# EAGLE schematic reset_circuit (EAGLE 9.2.2)
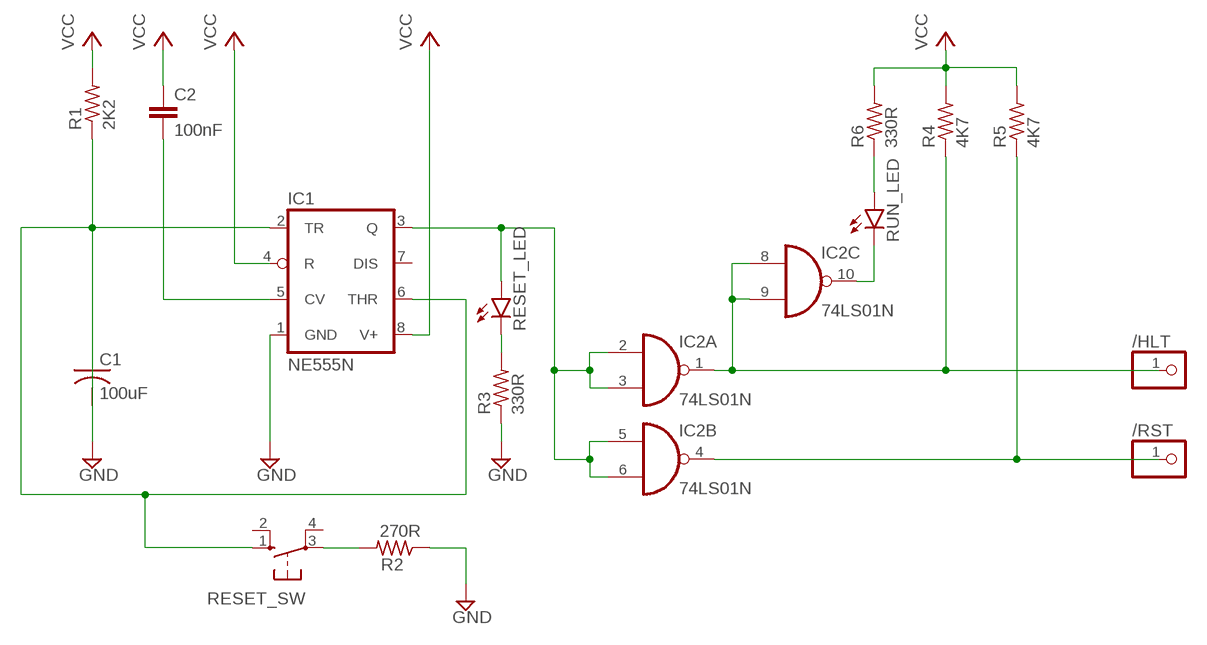
[diagram p0: schematic, sheet 1]

## Parts
/HLT  PINHD-1X1  [1X01]
/RST  PINHD-1X1  [1X01]
C1  100uF  C-US025-025X050  [C025-025X050]
C2  100nF  C2,5-3  [C2.5-3]
IC1  NE555N  [DIL08]
IC2  74LS01N  [DIL14]
R1  2K2  R-US_0204/7  [0204/7]
R2  270R  R-US_0204/7  [0204/7]
R3  330R  R-US_0204/7  [0204/7]
R4  4K7  R-US_0204/7  [0204/7]
R5  4K7  R-US_0204/7  [0204/7]
R6  330R  R-US_0204/7  [0204/7]
RESET_LED  LED5MM  [LED5MM]
RESET_SW  10-XX  [B3F-10XX]
RUN_LED  LED5MM  [LED5MM]

## Nets
GND: C1.1 IC1.1(GND) R2.1 R3.1
N$2: C1.2 IC1.2(TR) IC1.6(THR) R1.1 RESET_SW.1(S)
N$3: C2.2 IC1.5(CV)
N$4: IC1.3(Q) IC2.2(A:I0) IC2.3(A:I1) IC2.5(B:I0) IC2.6(B:I1) RESET_LED.A
N$5: R3.2 RESET_LED.K(C)
N$6: /HLT.1 IC2.1(A:O) IC2.8(C:I0) IC2.9(C:I1) R4.1
N$7: /RST.1 IC2.4(B:O) R5.1
N$8: IC2.10(C:O) RUN_LED.K(C)
N$9: R6.1 RUN_LED.A
N$10: R2.2 RESET_SW.3(P)
VCC: C2.1 IC1.4(R) IC1.8(V+) R1.2 R4.2 R5.2 R6.2
Unconnected: IC1.7(DIS) IC2.11(D:I0) IC2.12(D:I1) IC2.13(D:O) RESET_SW.2(S1) RESET_SW.4(P1)

## Power pins joined to a net without a drawn wire
GND: IC2.7(P:GND)
VCC: IC2.14(P:VCC)

## Library data of the parts
/HLT /RST = pinhead:PINHD-1X1: PIN HEADER
C1 = rcl:C-US: CAPACITOR, American symbol; SPICEPREFIX: C
C2 = capacitor-wima:C: CAPACITOR naming: grid - package width
IC1 = linear:*555: TIMER
IC2 = 74xx-eu:74*01: Quad 2-input NAND gate, open collector
R1-R6 = rcl:R-US_: RESISTOR, American symbol; SPICEPREFIX: R
RESET_LED RUN_LED = led:LED: LED OSRAM: - CHIPLED LG R971, LG N971, LY N971, LG Q971, LY Q971, LO R971, LY R971 LH N974, LH R974 LS Q976, LO Q976, LY Q976 LO Q996 - Hyper CHIPLED LW Q18S LB Q993, LB Q99A, LB R99A - SideLED LS A670, LO A670, LY A670, LG A670, LP A670 LB A673, LV A673, LT A673, LW A673 LH A674 LY A675 LS A676, LA A676, LO A676, LY A676, LW A676 LS A679, LY A679, LG A679 - Hyper Micro SIDELED® LS Y876, LA Y876, LO Y876, LY Y876 LT Y87S - SmartLED LW L88C, LW L88S LB L89C, LB L89S, LG L890 LS L89K, LO L89K, LY L89K LS L896, LA L896, LO L896, LY L896 - TOPLED LS T670, LO T670, LY T670, LG T670, LP T670 LSG T670, LSP T670, LSY T670, LOP T670, LYG T670 LG T671, LOG T671, LSG T671 LB T673, LV T673, LT T673, LW T673 LH T674 LS T676, LA T676, LO T676, LY T676, LB T676, LH T676, LSB T676, LW T676 LB T67C, LV T67C, LT T67C, LS T67K, LO T67K, LY T67K, LW E67C LS E67B, LA E67B, LO E67B, LY E67B, LB E67C, LV E67C, LT E67C LW T67C LS T679, LY T679, LG T679 LS T770, LO T770, LY T770, LG T770, LP T770 LB T773, LV T773, LT T773, LW T773 LH T774 LS E675, LA E675, LY E675, LS T675 LS T776, LA T776, LO T776, LY T776, LB T776 LHGB T686 LT T68C, LB T68C - Hyper Mini TOPLED® LB M676 - Mini TOPLED Santana® LG M470 LS M47K, LO M47K, LY M47K Source: http://www.osram.convergy.de LUXEON: - LUMILED® LXK2-PW12-R00, LXK2-PW12-S00, LXK2-PW14-U00, LXK2-PW14-V00 LXK2-PM12-R00, LXK2-PM12-S00, LXK2-PM14-U00 LXK2-PE12-Q00, LXK2-PE12-R00, LXK2-PE12-S00, LXK2-PE14-T00, LXK2-PE14-U00 LXK2-PB12-K00, LXK2-PB12-L00, LXK2-PB12-M00, LXK2-PB14-N00, LXK2-PB14-P00, LXK2-PB14-Q00 LXK2-PR12-L00, LXK2-PR12-M00, LXK2-PR14-Q00, LXK2-PR14-R00 LXK2-PD12-Q00, LXK2-PD12-R00, LXK2-PD12-S00 LXK2-PH12-R00, LXK2-PH12-S00 LXK2-PL12-P00, LXK2-PL12-Q00, LXK2-PL12-R00 Source: www.luxeon.com KINGBRIGHT: KA-3528ASYC Source: www.kingbright.com
RESET_SW = switch-omron:10-XX: OMRON SWITCH; MPN: B3F-1000; OC_FARNELL: 176432; OC_NEWARK: 36M3542